# Altium schematic sheet CONFIGURATION_&_STORAGE_&_USER_LEDS_BUTTONS.SchDoc: CONFIGURATION_&_STORAGE_&_USER_LEDS_BUTTONS
size 420 x 297 mm; DrawnBy: Orhun Dabak; Revision: 1.0; SheetNumber: 8; SheetTotal: 7
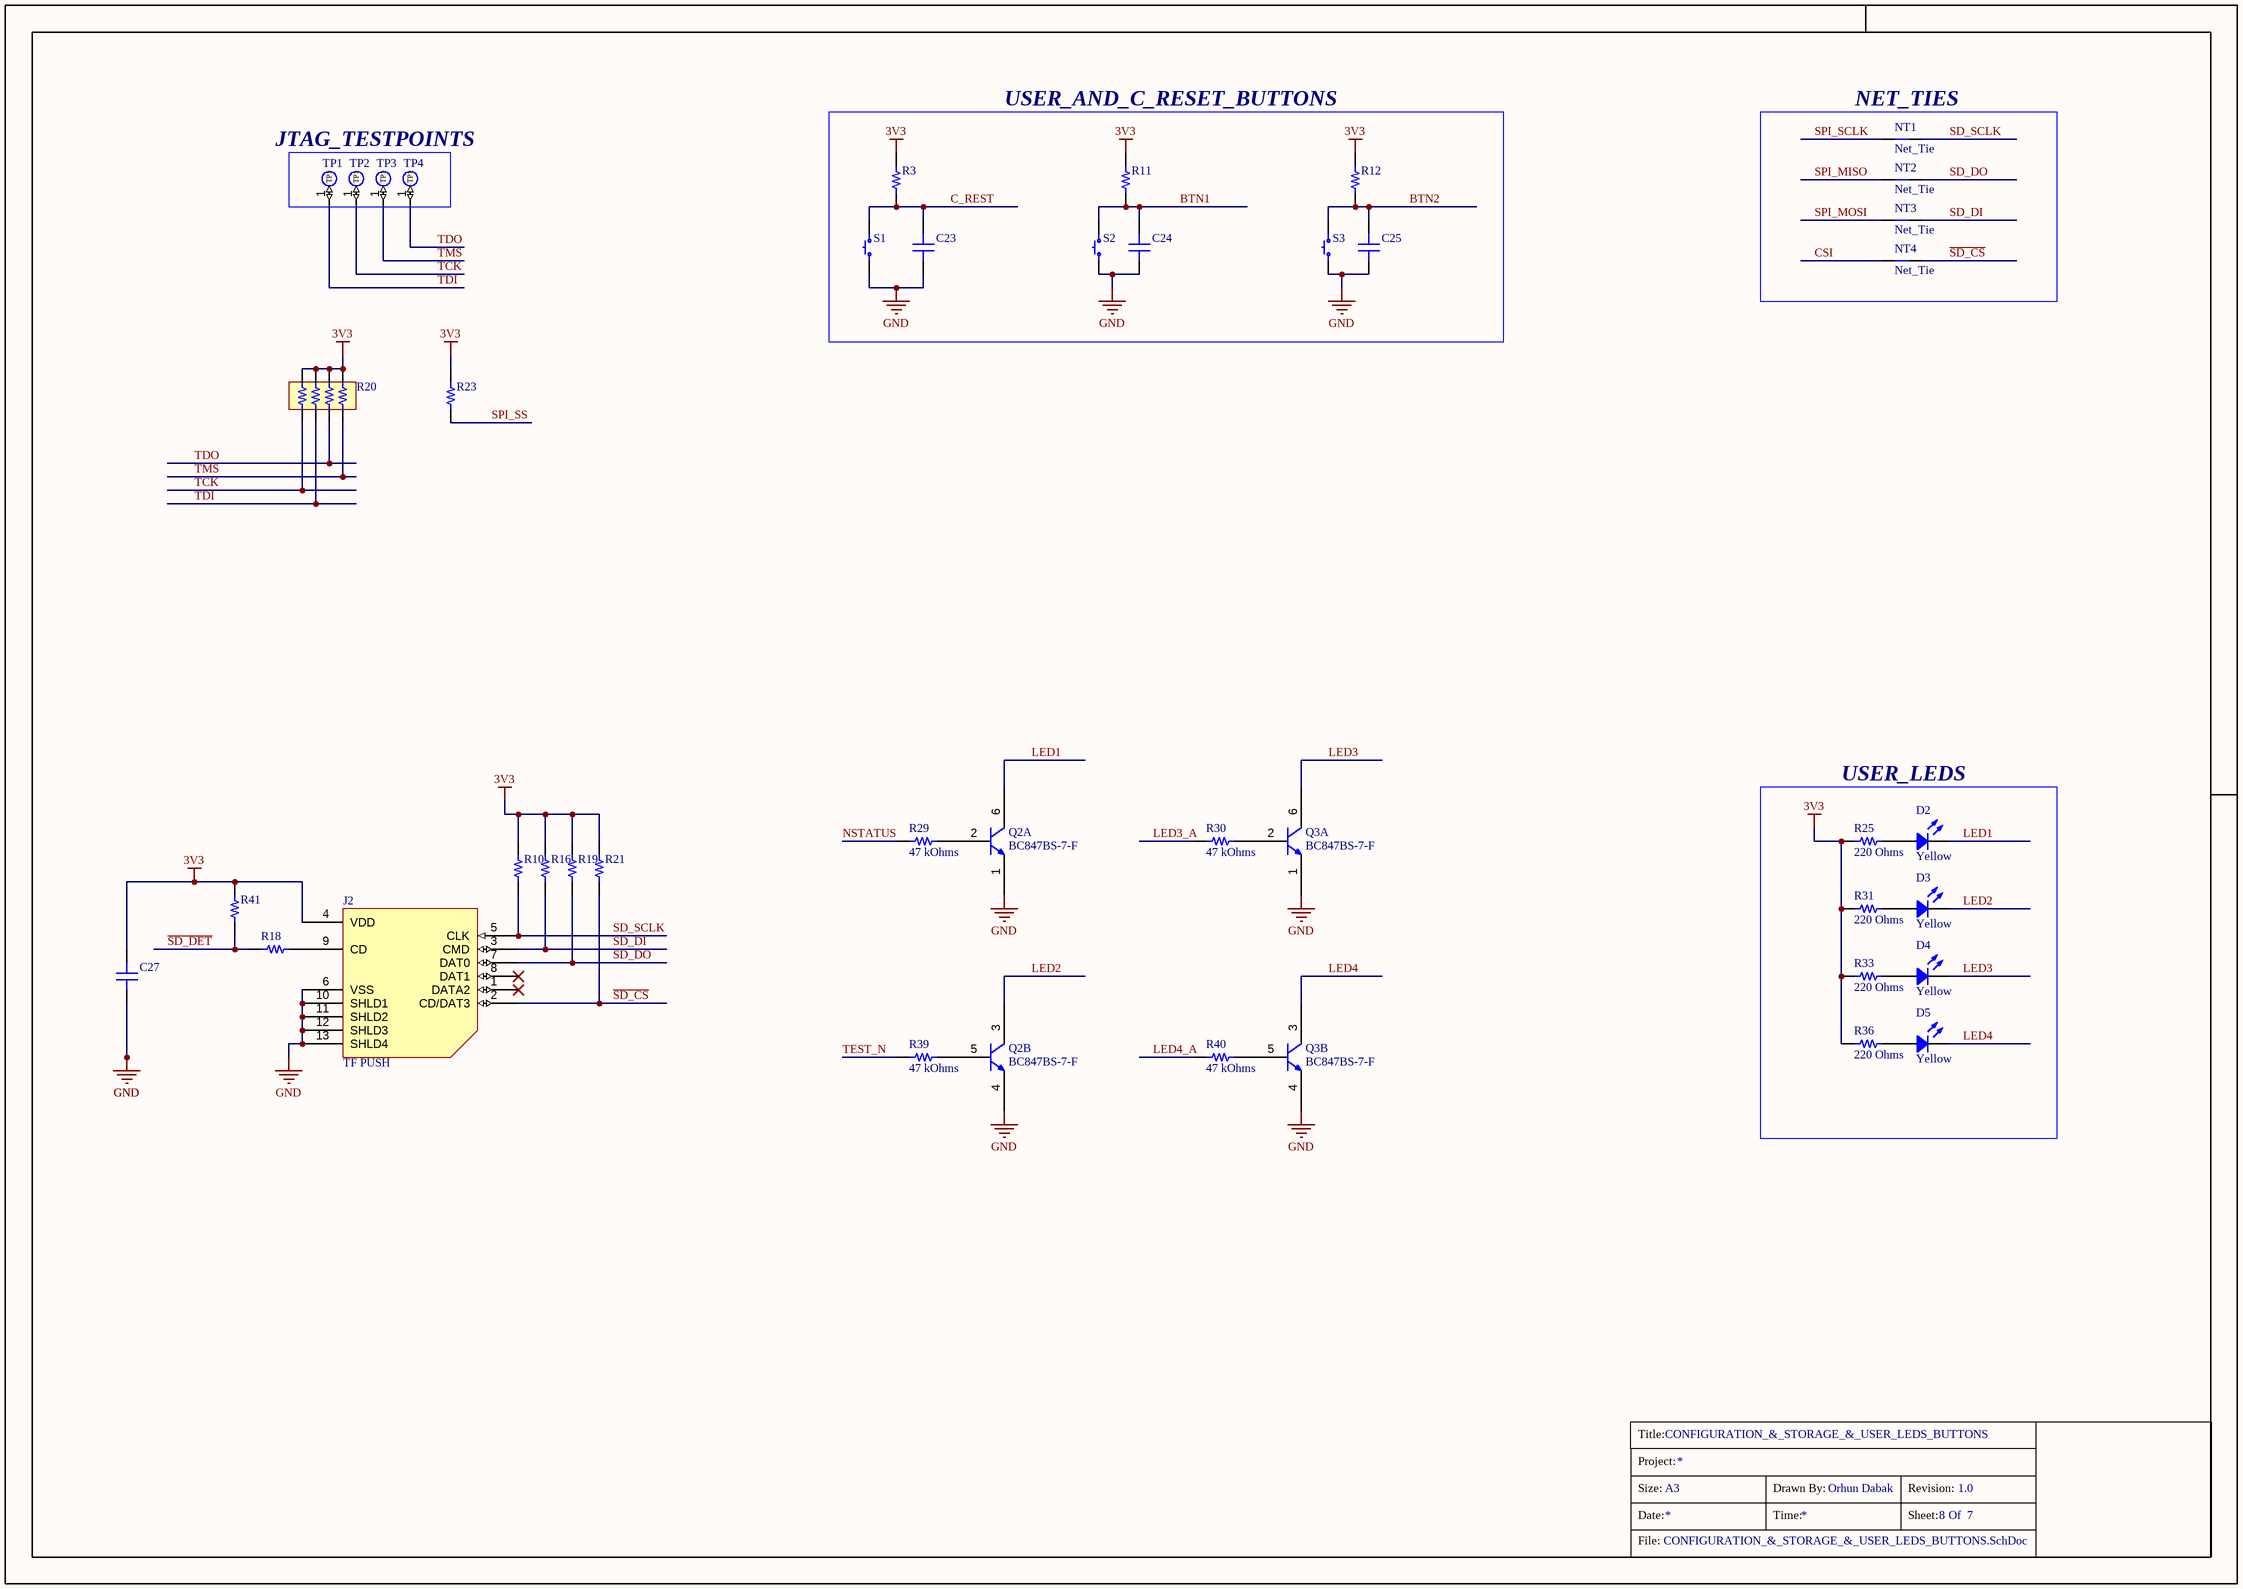
[diagram p0: CONFIGURATION_&_STORAGE_&_USER_LEDS_BUTTONS.SchDoc]

## Parts
?  (no value)  (graphical)
C23  10 µF  [CAP 0402_1005]  (value not drawn)
C24  10 µF  [CAP 0402_1005]  (value not drawn)
C25  10 µF  [CAP 0402_1005]  (value not drawn)
C27  0.1 µF  [CAP 0402_1005]  (value not drawn)
D2  Yellow  [LED 0603_1608 YELLOW]
D3  Yellow  [LED 0603_1608 YELLOW]
D4  Yellow  [LED 0603_1608 YELLOW]
D5  Yellow  [LED 0603_1608 YELLOW]
J2  TF PUSH  [TF PUSH]
NT1  Net_Tie  [Net_Tie 0.2X0.2]  (net tie, no BOM)
NT2  Net_Tie  [Net_Tie 0.2X0.2]  (net tie, no BOM)
NT3  Net_Tie  [Net_Tie 0.2X0.2]  (net tie, no BOM)
NT4  Net_Tie  [Net_Tie 0.2X0.2]  (net tie, no BOM)
Q2  BC847BS-7-F  [BC847BS-7-F-Footprint-1]  (parts A,B of 2)
Q3  BC847BS-7-F  [BC847BS-7-F-Footprint-1]  (parts A,B of 2)
R3  10 kOhms  [RES 0201_0603]  (value not drawn)
R10  10 kOhms  [RES 0201_0603]  (value not drawn)
R11  10 kOhms  [RES 0201_0603]  (value not drawn)
R12  10 kOhms  [RES 0201_0603]  (value not drawn)
R16  10 kOhms  [RES 0201_0603]  (value not drawn)
R18  0 Ohms  [RES 0201_0603]  (value not drawn)
R19  10 kOhms  [RES 0201_0603]  (value not drawn)
R20  YC124-JR-0710KL  [RESNET 0804-8 CONVEX]  (value not drawn)
R21  10 kOhms  [RES 0201_0603]  (value not drawn)
R23  10 kOhms  [RES 0201_0603]  (value not drawn)
R25  220 Ohms  [RES 0402_1005]
R29  47 kOhms  [RES 0201_0603]
R30  47 kOhms  [RES 0201_0603]
R31  220 Ohms  [RES 0402_1005]
R33  220 Ohms  [RES 0402_1005]
R36  220 Ohms  [RES 0402_1005]
R39  47 kOhms  [RES 0201_0603]
R40  47 kOhms  [RES 0201_0603]
R41  100 kOhms  [RES 0201_0603]  (value not drawn)
S1  TS342A2P-WZ  [TS342A2P-WZ]  (value not drawn)
S2  TS342A2P-WZ  [TS342A2P-WZ]  (value not drawn)
S3  TS342A2P-WZ  [TS342A2P-WZ]  (value not drawn)
TP1  TP_1  [TEST POINT]  (value not drawn)  (no BOM)
TP2  TP_1  [TEST POINT]  (value not drawn)  (no BOM)
TP3  TP_1  [TEST POINT]  (value not drawn)  (no BOM)
TP4  TP_1  [TEST POINT]  (value not drawn)  (no BOM)

## Blocks framed on the sheet
USER_AND_C_RESET_BUTTONS: C23-C25 R3 R11 R12 S1-S3
NET_TIES: NT1-NT4
USER_LEDS: D2-D5 R25 R31 R33 R36

## Nets
3V3: C27.2 J2.4(VDD) R3.2 R10.2 R11.2 R12.2 R16.2 R19.2 R20.5 R20.6 R20.7 R20.8 R21.2 R23.2 R25.1 R31.1 R33.1 R36.1 R41.2
GND: C23.1 C24.1 C25.1 C27.1 J2.6(VSS) J2.10(SHLD1) J2.11(SHLD2) J2.12(SHLD3) J2.13(SHLD4) Q2.1(Emitter) Q2.4(Emitter) Q3.1(Emitter) Q3.4(Emitter) S1.1 S2.1 S3.1
BTN1: C24.2 R11.1 S2.2
BTN2: C25.2 R12.1 S3.2
C_REST: C23.2 R3.1 S1.2
CSI: NT4.1
LED1: D2.2 Q2.6(Collector)
LED2: D3.2 Q2.3(Collector)
LED3: D4.2 Q3.6(Collector)
LED3_A: R30.1
LED4: D5.2 Q3.3(Collector)
LED4_A: R40.1
NSTATUS: R29.1
~{SD_CS}: J2.2(CD/DAT3) NT4.2 R21.1
~{SD_DET}: R18.1 R41.1
SD_DI: J2.3(CMD) NT3.2 R16.1
SD_DO: J2.7(DAT0) NT2.2 R19.1
SD_SCLK: J2.5(CLK) NT1.2 R10.1
SPI_MISO: NT2.1
SPI_MOSI: NT3.1
SPI_SCLK: NT1.1
SPI_SS: R23.1
TCK: R20.1 TP2.1(TP1)
TDI: R20.2 TP1.1(TP1)
TDO: R20.3 TP4.1(TP1)
TEST_N: R39.1
TMS: R20.4 TP3.1(TP1)
NetD2_1: D2.1 R25.2
NetD3_1: D3.1 R31.2
NetD4_1: D4.1 R33.2
NetD5_1: D5.1 R36.2
NetJ2_9: J2.9(CD) R18.2
NetQ2_2: Q2.2(Base) R29.2
NetQ2_5: Q2.5(Base) R39.2
NetQ3_2: Q3.2(Base) R30.2
NetQ3_5: Q3.5(Base) R40.2

Not connected (* = marked no-connect by the designer): J2 1(DATA2)* 8(DAT1)*

## Notes on the sheet
- JTAG_TESTPOINTS
- Title:
- Project:
- Size:
- Date:
- File:
- A3
- Time:
- Drawn By:
- Sheet:
- Revision:
- Of

## Library data of the parts
? = Title_Block
C23-C25 = GRM155R61A106ME11D: CAP CER 10UF 10V X5R 0402; manufacturer: Murata Electronics; Tolerance: ±20%; Part Number: GRM155R61A106ME11D; Value: 10 µF; Applications: General Purpose; Capacitance: 10 µF; componentlink2description: DigiKey Link; componentlink2url: https://www.digikey.com/en/products/detail/murata-electronics/GRM155R61A106ME11D/12091056; Device Package: 0402 (1005 Metric); lastupdated: 19/09/2022 12:56:37; Lifecycle Status: Active; Minimum Order: 1; Mounting Type: Surface Mount, MLCC; Operating Temperature: -55°C ~ 85°C; Package / Case: 0402 (1005 Metric); packaging: TapeAndReel; partid: 45464; Part Status: Active; price: 0.02; series: GRM; Size / Dimension: 0.039" L x 0.020" W (1.00mm x 0.50mm); Supplier 1: DigiKey; Supplier Part Number 1: 490-GRM155R61A106ME11DCT-ND; Temperature Coefficient: X5R; Thickness (Max): 0.028" (0.70mm); Voltage - Rated: 10V
C27 = CC0402KRX7R6BB104: CAP CER 0.1UF 10V X7R 0402; manufacturer: Yageo; Tolerance: ±10%; Part Number: CC0402KRX7R6BB104; Value: 0.1 µF; Applications: General Purpose; Capacitance: 0.1 µF; componentlink1description: Datasheet; componentlink1url: https://www.yageo.com/upload/media/product/productsearch/datasheet/mlcc/UPY-GPHC_X7R_6.3V-to-50V_18.pdf; componentlink2description: DigiKey Link; componentlink2url: https://www.digikey.com/en/products/detail/yageo/CC0402KRX7R6BB104/2103083; Device Package: 0402 (1005 Metric); lastupdated: 19/09/2022 12:57:28; Lifecycle Status: Active; Minimum Order: 1; Mounting Type: Surface Mount, MLCC; Operating Temperature: -55°C ~ 125°C; Package / Case: 0402 (1005 Metric); packaging: CutTape; partid: 3877; Part Status: Active; price: 0.01; series: CC; Size / Dimension: 0.039" L x 0.020" W (1.00mm x 0.50mm); Supplier 1: DigiKey; Supplier Part Number 1: 311-1345-1-ND; Temperature Coefficient: X7R; Thickness (Max): 0.022" (0.55mm); Voltage - Rated: 10V
D2-D5 = SML-LX0603YW-TR: LED YELLOW DIFFUSED SMD; Manufacturer: Lumex Opto/Components Inc.; Configuration: Standard; Current - Test: 20mA; Lens Color: White; Lens Size: 1.00mm x 0.80mm; Lens Style: Rectangle with Flat Top; Millicandela Rating: 14mcd; Viewing Angle: 160°; Voltage - Forward (Vf) (Typ): 2.1V; Wavelength - Peak: 585nm; Part Number: SML-LX0603YW-TR; Color: Yellow; ComponentLink1Description: Datasheet; ComponentLink1URL: https://www.lumex.com/content/files/ProductAttachment/SML-LX0603YW-TR.pdf; ComponentLink2Description: DigiKey Link; ComponentLink2URL: https://www.digikey.com/en/products/detail/lumex-opto-components-inc/SML-LX0603YW-TR/304361; Device Package: 0603 (1608 Metric); Height (Max): 0.60mm; LastUpdated: 19/09/2022 13:51:05; Lens Transparency: Diffused; Lifecycle Status: Active; Minimum Order: 1; Mounting Type: Surface Mount; Package / Case: 0603 (1608 Metric); Packaging: TapeAndReel; PartId: 92; Part Status: Active; Price: 0.05; Series: -; Size / Dimension: 1.60mm L x 0.80mm W; Supplier 1: DigiKey; Supplier Part Number 1: 67-1550-1-ND; Value: Yellow
J2 = TF PUSH: -20℃~+90℃ 2mm Deck MicroSD card (TF card) Self bomb SMD SD Card Connectors ROHS; Manufacturer: SHOU HAN; ComponentLink1Description: Datasheet; ComponentLink1URL: https://datasheet.lcsc.com/lcsc/1912111437_SHOU-HAN-TF-PUSH_C393941.pdf; ComponentLink2Description: LCSC Link; ComponentLink2URL: https://www.lcsc.com/product-detail/SD-Card-Connectors_SHOU-HAN-TF-PUSH_C393941.html; Manufacturer Part Number: TF PUSH; LCSC Part Number: C393941; Package: SMD; Category: Connectors/SD Card Connectors; Operating Temperature Range: -20℃~+90℃; Maximum Body Height: 2mm; Connector Type: Deck; Card Type: MicroSD card (TF card); Card Connection Mode: Self bomb
NT1-NT4 = Net_Tie: Net Tie
Q2 Q3 = CMP-013-00035-3: 2NPN Ic=100mA Vceo=45V hfe=200~450 P=200mW SOT363
R3 R11 R12 R23 = RC0201FR-0710KL: RES 10K OHM 1% 1/20W 0201; Manufacturer: Yageo; Power (Watts): 0.05W, 1/20W; Temperature Coefficient: ±200ppm/°C; Part Number: RC0201FR-0710KL; Value: 10 kOhms; ComponentLink1Description: Datasheet; ComponentLink1URL: https://www.yageo.com/upload/media/product/productsearch/datasheet/rchip/PYu-RC_Group_51_RoHS_L_10.pdf; ComponentLink2Description: DigiKey Link; ComponentLink2URL: https://www.digikey.com/en/products/detail/yageo/RC0201FR-0710KL/1948870; Composition: Thick Film; Device Package: 0201 (0603 Metric); Features: Moisture Resistant; Height - Seated (Max): 0.010" (0.26mm); LastUpdated: 19/09/2022 13:09:03; Lifecycle Status: Active; Minimum Order: 1; Number of Terminations: 2; Operating Temperature: -55°C ~ 125°C; Package / Case: 0201 (0603 Metric); Packaging: CutTape; PartId: 2281; Part Status: Active; Price: 0.01; Resistance: 10 kOhms; Series: RC_L; Size / Dimension: 0.024" L x 0.012" W (0.60mm x 0.30mm); Supplier 1: DigiKey; Supplier Part Number 1: 311-10.0KMCT-ND; Supplier Device Package: 0201; Tolerance: ±1%
R10 R16 R19 R21 = CRCW020110K0FKED: RES SMD 10K OHM 1% 1/20W 0201; Manufacturer: Vishay Dale; Power (Watts): 0.05W, 1/20W; Temperature Coefficient: ±100ppm/°C; Part Number: CRCW020110K0FKED; Value: 10 kOhms; ComponentLink1Description: Datasheet; ComponentLink1URL: http://www.vishay.com/docs/20052/crcw0201e3.pdf; ComponentLink2Description: DigiKey Link; ComponentLink2URL: https://www.digikey.com/en/products/detail/vishay-dale/CRCW020110K0FKED/1967989; Composition: Thick Film; Device Package: 0201 (0603 Metric); Height - Seated (Max): 0.010" (0.26mm); LastUpdated: 9/19/2022 01:09:18 PM; Lifecycle Status: Active; Minimum Order: 1; Number of Terminations: 2; Operating Temperature: -55°C ~ 155°C; Package / Case: 0201 (0603 Metric); Packaging: TapeAndReel; PartId: 29; Part Status: Active; Price: 0.03; Resistance: 10 kOhms; Series: CRCW; Size / Dimension: 0.024" L x 0.012" W (0.60mm x 0.30mm); Supplier 1: DigiKey; Supplier Part Number 1: 541-10.0KAABCT-ND; Supplier Device Package: 0201; Tolerance: ±1%
R18 = RC0201JR-070RL: RES 0 OHM JUMPER 1/20W 0201; Manufacturer: Yageo; Power (Watts): 0.05W, 1/20W; Part Number: RC0201JR-070RL; Value: 0 Ohms; ComponentLink1Description: Datasheet; ComponentLink1URL: https://www.yageo.com/upload/media/product/productsearch/datasheet/rchip/PYu-RC_Group_51_RoHS_L_10.pdf; ComponentLink2Description: DigiKey Link; ComponentLink2URL: https://www.digikey.com/en/products/detail/yageo/RC0201JR-070RL/1948898; Composition: Thick Film; Device Package: 0201 (0603 Metric); Features: Moisture Resistant; Height - Seated (Max): 0.010" (0.26mm); LastUpdated: 19/09/2022 13:09:03; Lifecycle Status: Active; Minimum Order: 1; Number of Terminations: 2; Operating Temperature: -55°C ~ 125°C; Package / Case: 0201 (0603 Metric); Packaging: CutTape; PartId: 2293; Part Status: Active; Price: 0.01; Resistance: 0 Ohms; Series: RC_L; Size / Dimension: 0.024" L x 0.012" W (0.60mm x 0.30mm); Supplier 1: DigiKey; Supplier Part Number 1: 311-0.0NCT-ND; Supplier Device Package: 0201; Tolerance: Jumper
R20 = YC124-JR-0710KL: RES ARRAY 4 RES 10K OHM 0804; Manufacturer: Yageo; Circuit Type: Isolated; Number of Resistors: 4; Power Per Element: 62.5mW; Temperature Coefficient: ±200ppm/°C; Tolerance: ±5%; Part Number: YC124-JR-0710KL; Applications: Automotive AEC-Q200, DDRAM, SDRAM; ComponentLink1Description: Datasheet; ComponentLink1URL: https://www.yageo.com/upload/media/product/productsearch/datasheet/rchip/PYu-YC_TC_group_51_RoHS_L_9.pdf; ComponentLink2Description: DigiKey Link; ComponentLink2URL: https://www.digikey.com/en/products/detail/yageo/YC124-JR-0710KL/1005019; Height - Seated (Max): 0.022" (0.55mm); LastUpdated: 19/09/2022 13:54:50; Lifecycle Status: Active; Minimum Order: 1; Mounting Type: Surface Mount; Number of Pins: 8; Operating Temperature: -55°C ~ 155°C; Package / Case: 0804, Convex, Long Side Terminals; Packaging: TapeAndReel; PartId: 471; Part Status: Active; Price: 0.01; Resistance (Ohms): 10k; Series: YC124; Size / Dimension: 0.079" L x 0.039" W (2.00mm x 1.00mm); Supplier 1: DigiKey; Supplier Part Number 1: YC124J-10KCT-ND
R25 R31 R33 R36 = RC0402FR-07220RL: RES 220 OHM 1% 1/16W 0402; Manufacturer: Yageo; Power (Watts): 0.063W, 1/16W; Temperature Coefficient: ±100ppm/°C; Part Number: RC0402FR-07220RL; Value: 220 Ohms; ComponentLink1Description: Datasheet; ComponentLink1URL: https://www.yageo.com/upload/media/product/productsearch/datasheet/rchip/PYu-RC_Group_51_RoHS_L_10.pdf; ComponentLink2Description: DigiKey Link; ComponentLink2URL: https://www.digikey.com/en/products/detail/yageo/RC0402FR-07220RL/726565; Composition: Thick Film; Device Package: 0402 (1005 Metric); Features: Moisture Resistant; Height - Seated (Max): 0.016" (0.40mm); LastUpdated: 19/09/2022 13:14:14; Lifecycle Status: Active; Minimum Order: 1; Number of Terminations: 2; Operating Temperature: -55°C ~ 155°C; Package / Case: 0402 (1005 Metric); Packaging: CutTape; PartId: 17956; Part Status: Active; Price: 0.01; Resistance: 220 Ohms; Series: RC_L; Size / Dimension: 0.039" L x 0.020" W (1.00mm x 0.50mm); Supplier 1: DigiKey; Supplier Part Number 1: 311-220LRCT-ND; Supplier Device Package: 0402; Tolerance: ±1%
R29 R30 R39 R40 = RC0201FR-0747KL: RES 47K OHM 1% 1/20W 0201; Manufacturer: Yageo; Power (Watts): 0.05W, 1/20W; Temperature Coefficient: ±200ppm/°C; Part Number: RC0201FR-0747KL; Value: 47 kOhms; ComponentLink1Description: Datasheet; ComponentLink1URL: https://www.yageo.com/upload/media/product/productsearch/datasheet/rchip/PYu-RC_Group_51_RoHS_L_10.pdf; ComponentLink2Description: DigiKey Link; ComponentLink2URL: https://www.digikey.com/en/products/detail/yageo/RC0201FR-0747KL/3202409; Composition: Thick Film; Device Package: 0201 (0603 Metric); Features: Moisture Resistant; Height - Seated (Max): 0.010" (0.26mm); LastUpdated: 19/09/2022 13:09:03; Lifecycle Status: Active; Minimum Order: 1; Number of Terminations: 2; Operating Temperature: -55°C ~ 125°C; Package / Case: 0201 (0603 Metric); Packaging: CutTape; PartId: 2291; Part Status: Active; Price: 0.01; Resistance: 47 kOhms; Series: RC_L; Size / Dimension: 0.024" L x 0.012" W (0.60mm x 0.30mm); Supplier 1: DigiKey; Supplier Part Number 1: 311-47KMCT-ND; Supplier Device Package: 0201; Tolerance: ±1%
R41 = CRG0201F100K: RES SMD 100K OHM 1% 1/20W 0201; Manufacturer: TE Connectivity Passive Product; Power (Watts): 0.05W, 1/20W; Temperature Coefficient: ±200ppm/°C; Part Number: CRG0201F100K; Value: 100 kOhms; ComponentLink1Description: Datasheet; ComponentLink1URL: https://www.te.com/commerce/DocumentDelivery/DDEController?Action=srchrtrv&DocNm=1773204&DocType=DS&DocLang=English; ComponentLink2Description: DigiKey Link; ComponentLink2URL: https://www.digikey.com/en/products/detail/te-connectivity-passive-product/CRG0201F100K/4489642; Composition: Thick Film; Device Package: 0201 (0603 Metric); Height - Seated (Max): 0.010" (0.26mm); LastUpdated: 9/19/2022 01:09:18 PM; Lifecycle Status: Active; Minimum Order: 1; Number of Terminations: 2; Operating Temperature: -55°C ~ 155°C; Package / Case: 0201 (0603 Metric); Packaging: TapeAndReel; PartId: 2; Part Status: Active; Price: 0.02; Resistance: 100 kOhms; Series: CRG, Neohm; Size / Dimension: 0.024" L x 0.012" W (0.60mm x 0.30mm); Supplier 1: DigiKey; Supplier Part Number 1: A129572CT-ND; Supplier Device Package: 0201; Tolerance: ±1%
S1-S3 = TS342A2P-WZ: NO SMDSplicing 50mA 3.95mm 100MΩ 30000 12V 2.9mm -25℃~+70℃ 2mm Black Round Button Brick nogging SPST SMD Tactile Switches ROHS; Manufacturer: SHOU HAN; Mechanical Life: 30000; ComponentLink1Description: Datasheet; ComponentLink1URL: https://datasheet.lcsc.com/lcsc/2005221232_SHOU-HAN-TS342A2P-WZ_C557591.pdf; ComponentLink2Description: LCSC Link; ComponentLink2URL: https://www.lcsc.com/product-detail/Tactile-Switches_SHOU-HAN-TS342A2P-WZ_C557591.html; Manufacturer Part Number: TS342A2P-WZ; JLCPCB Part Number: C557591; Package: SMD; Contact Current: 50mA; Switch Length: 3.95mm; Insulation Resistance: 100MΩ; Voltage Rating (DC): 12V; Switch Width: 2.9mm; Actuator/Cap Color: Black; Actuator Style: Round Button; Mounting Style: Brick nogging; Circuit: SPST
TP1-TP4 = TEST POINT_1(I/O): 1.5x1.5mm Test Point(I/O)